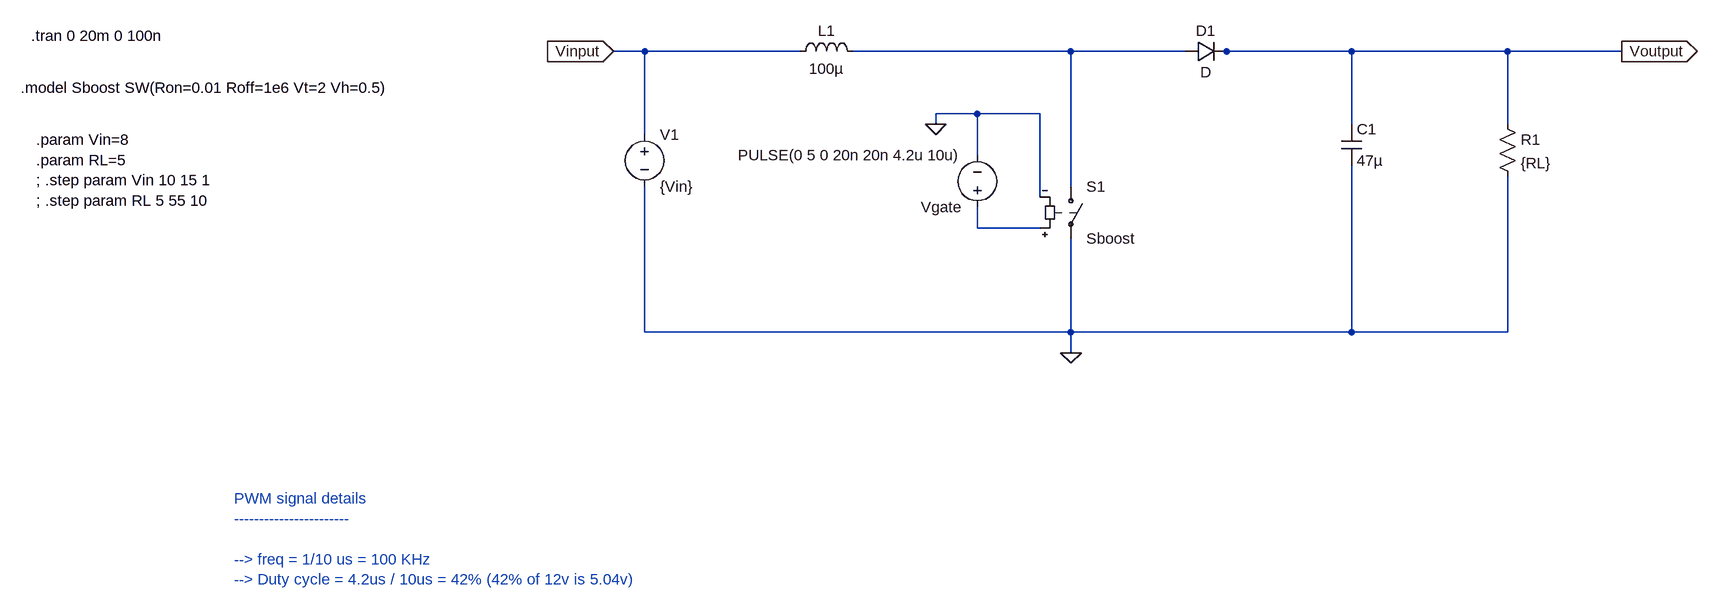
[diagram p0: schematic Boost_converter.asc]
Boost_converter.asc, the LTspice schematic file:
Version 4.1
SHEET 1 1464 1320
WIRE -192 0 -240 0
WIRE 48 0 -192 0
WIRE 464 0 128 0
WIRE 640 0 464 0
WIRE 704 0 688 0
WIRE 896 0 704 0
WIRE 1136 0 896 0
WIRE 1312 0 1136 0
WIRE 320 96 256 96
WIRE 416 96 320 96
WIRE 256 112 256 96
WIRE 896 112 896 0
WIRE 1136 112 1136 0
WIRE -192 128 -192 0
WIRE 320 160 320 96
WIRE 464 208 464 0
WIRE 416 224 416 96
WIRE 320 272 320 240
WIRE 416 272 320 272
WIRE -192 432 -192 208
WIRE 464 432 464 288
WIRE 464 432 -192 432
WIRE 896 432 896 176
WIRE 896 432 464 432
WIRE 1136 432 1136 192
WIRE 1136 432 896 432
WIRE 464 464 464 432
FLAG 464 464 0
FLAG 1312 0 Voutput
IOPIN 1312 0 Out
FLAG -240 0 Vinput
IOPIN -240 0 In
FLAG 256 112 0
SYMBOL voltage -192 112 R0
WINDOW 123 0 0 Left 0
WINDOW 39 0 0 Left 0
SYMATTR InstName V1
SYMATTR Value {Vin}
SYMBOL sw 464 192 R0
SYMATTR InstName S1
SYMATTR Value Sboost
SYMBOL diode 640 16 R270
WINDOW 0 32 32 VTop 2
WINDOW 3 0 32 VBottom 2
SYMATTR InstName D1
SYMBOL ind 32 16 R270
WINDOW 0 32 56 VTop 2
WINDOW 3 5 56 VBottom 2
SYMATTR InstName L1
SYMATTR Value 100µ
SYMBOL cap 880 112 R0
SYMATTR InstName C1
SYMATTR Value 47µ
SYMBOL res 1120 96 R0
SYMATTR InstName R1
SYMATTR Value {RL}
SYMBOL voltage 320 256 R180
WINDOW 123 0 0 Left 0
WINDOW 39 0 0 Left 0
SYMATTR InstName Vgate
SYMATTR Value PULSE(0 5 0 20n 20n 4.2u 10u)
TEXT -824 688 Left 2 ;PWM signal details\n-----------------------\n \n--> freq = 1/10 us = 100 KHz\n--> Duty cycle = 4.2us / 10us = 42% (42% of 12v is 5.04v)
TEXT -1152 56 Left 2 !.model Sboost SW(Ron=0.01 Roff=1e6 Vt=2 Vh=0.5)
TEXT -1136 -24 Left 2 !.tran 0 20m 0 100n
TEXT -1128 136 Left 2 !.param Vin=8\n.param RL=5\n; .step param Vin 10 15 1\n; .step param RL 5 55 10

The netlist it stands for:
* Boost_converter.asc
V1 Vinput 0 {Vin}
S1 N001 0 N002 0 Sboost
D1 N001 Voutput D
L1 Vinput N001 100µ
C1 Voutput 0 47µ
R1 Voutput 0 {RL}
Vgate N002 0 PULSE(0 5 0 20n 20n 4.2u 10u)
.model D D
.lib standard.dio
* PWM signal details
* -----------------------
* --> freq = 1/10 us = 100 KHz
* --> Duty cycle = 4.2us / 10us = 42% (42% of 12v is 5.04v)
.model Sboost SW(Ron=0.01 Roff=1e6 Vt=2 Vh=0.5)
.tran 0 20m 0 100n
.param Vin=8
.param RL=5
; .step param Vin 10 15 1
; .step param RL 5 55 10
.backanno
.end